# Altium schematic sheet 1-Power.SCHDOC
size A4
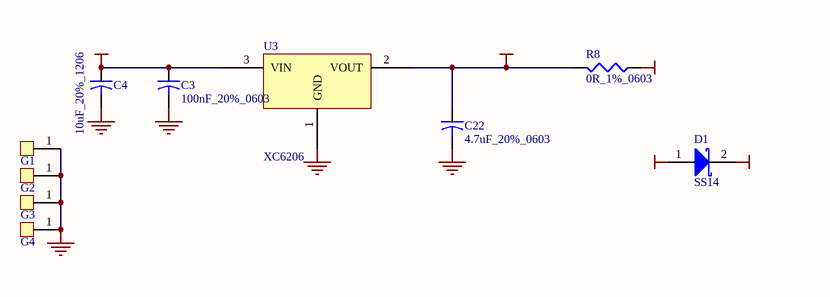
[diagram p0: 1-Power.SCHDOC]

## Parts
C3  100nF_20%_0603  [C1608-0603]
C4  10uF_20%_1206  [CC3216-1206]
C22  4.7uF_20%_0603  [C1608-0603]
D1  SS14  [LED0805]
G1  ND  [END_3_6]  (value not drawn)
G2  ND  [END_3_6]  (value not drawn)
G3  ND  [END_3_6]  (value not drawn)
G4  ND  [END_3_6]  (value not drawn)
R8  0R_1%_0603  [C1608-0603]
U3  XC6206  [SO-G3/C2.5]

## Nets
GND: C3.2 C4.2 C22.2 G1.1(SW) G2.1(SW) G3.1(SW) G4.1(SW) U3.1(GND)
VCC_2V8: C22.1 R8.2 U3.2(VOUT)
VCC_5V: C3.1 C4.1 D1.1(A) U3.3(VIN)
VCC_MCU: R8.1
VCC_TH: D1.2(K)

## Library data of the parts
C3 C4 C22 = Cap2: Capacitor; Value: 0.1uF 20% 0603; Published: 23-Sep-2002; Publisher: Altium Limited
D1 = D Schottky: Schottky Diode; Code - JEDEC: DO-214-AA; Published: 8-Jun-2000; Revision: July-2002: Re-released for DXP Platform.; Publisher: Altium Limited
R8 = Res3: Resistor; Value: 1K%5 0603; Published: 8-Jun-2000; Revision: July-2002: Re-released for DXP Platform.; Publisher: Altium Limited